# Altium schematic sheet power-section.SchDoc
size B
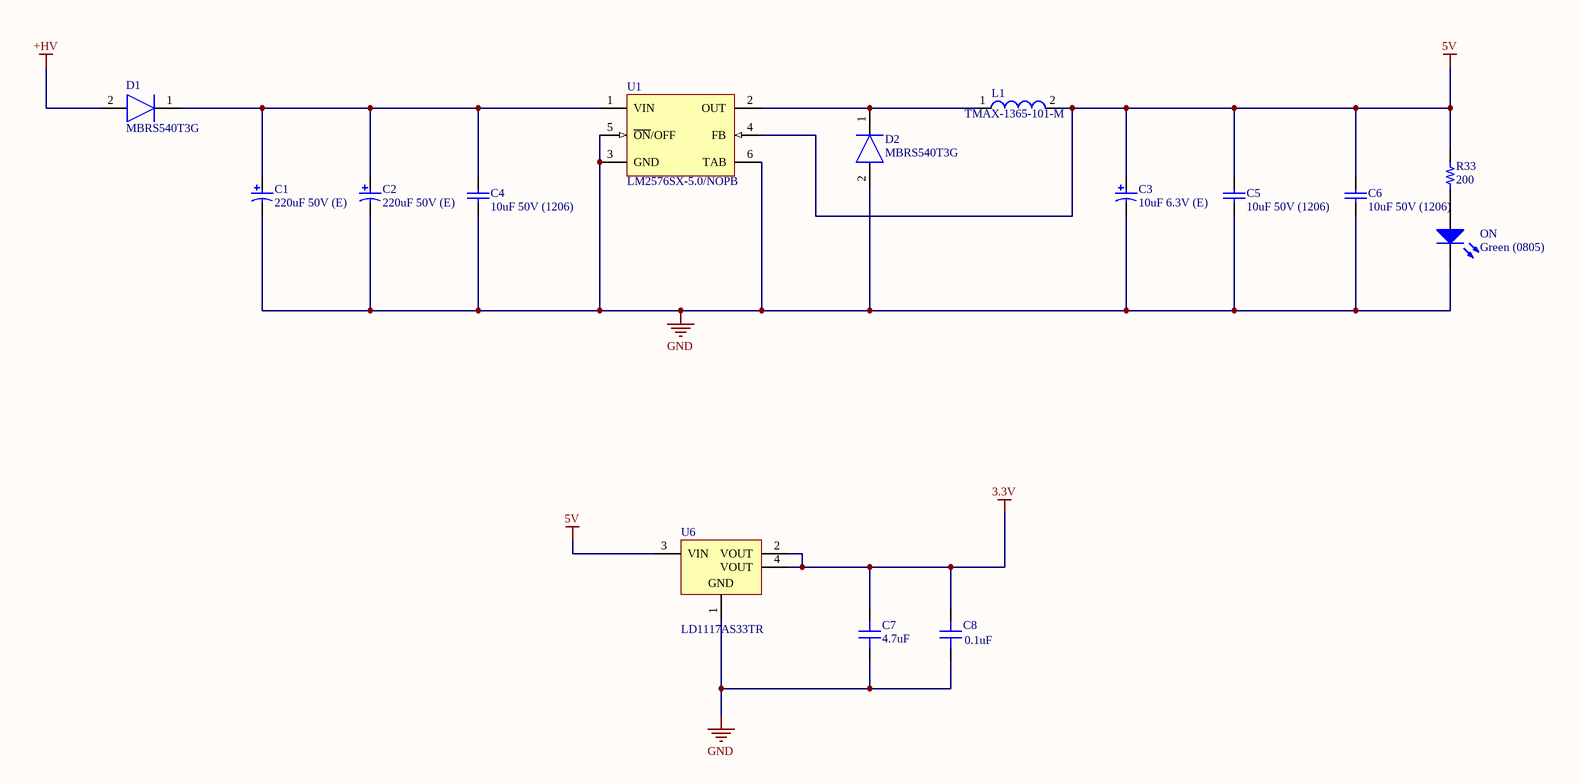
[diagram p0: power-section.SchDoc]

## Parts
C1  220uF 50V (E)  [PNSC-EEE-1HA221P_L]
C2  220uF 50V (E)  [PNSC-EEE-1HA221P_L]
C3  10uF 6.3V (E)  [NIC-CAPA2-8X10_V]
C4  10uF 50V (1206)  [CAPC3216X229X50LL20T25]
C5  10uF 50V (1206)  [CAPC3216X229X50LL20T25]
C6  10uF 50V (1206)  [CAPC3216X229X50LL20T25]
C7  4.7uF  [CAP 1206_3216 - 1.8MM]
C8  0.1uF  [CAP 0603_1608]
D1  MBRS540T3G  [DIOM7958X256N]
D2  MBRS540T3G  [DIOM7958X256N]
L1  TMAX-1365-101-M  [WE-HCI-1365]
ON  Green (0805)  [0805_A]
R33  200  [RES 0603_1608]
U1  LM2576SX-5.0/NOPB  [KTT0005B_M]
U6  LD1117AS33TR  [SOT-223_M]

## Nets
3.3V: C7.2 C8.2 U6.2(VOUT) U6.4(VOUT)
5V: C3.1 C5.2 C6.2 L1.2 R33.2 U1.4(FB) U6.3(VIN)
+HV: D1.2(A)
GND: C1.2 C2.2 C3.2 C4.1 C5.1 C6.1 C7.1 C8.1 D2.2(A) ON.1(K) U1.3(GND) U1.5(~{ON}/OFF) U1.6(TAB) U6.1(GND)
NetC1_1: C1.1 C2.1 C4.2 D1.1(K) U1.1(VIN)
NetD2_1: D2.1(K) L1.1 U1.2(OUT)
NetON_2: ON.2(A) R33.1

## Notes on the sheet
- Title
- Size:
- Date:
- B
- Number:
- Time:
- Revision:
- Sheet
- of
- Maptix Co.,Ltd
- 99/193 Atoll Bali Beach
- Khlong Luang Phaeng
- Chacheongsao
- Thailand 24000
- File:

## Library data of the parts
C1 C2 = CMP-2000-06200-1: Aluminum Electrolytic Capacitor, 220 uF, +/- 20%, 50 V, -40 to 85 degC, 2-Pin SMD, RoHS, Tape and Reel; Manufacturer: Panasonic; Lifetime @ Temperature: 2000hours@85°C; AE Capacitor Case: RadialCan-SMD; Capacitance: 220µF; Ripple Current AC: 300mA; SVHC: ToBeAdvised; Product Range: PANASONIC-SSeries; Datasheet Version: 11/2012; Manufacturer URL: http://www.panasonic.com/; Packaging: CutTape; Life Time @ Temperature: 2000hours@85°C; Capacitor Case Style: RadialCan-SMD; Capacitance Tolerance ±: ±20%; Mounting Technology: SurfaceMount; Operating Temperature Max: 85°C; Capacitance Tolerance: ±20%; Package Description: 2-Pin Surface Mount Device, Body 10.3 x 10.3 mm; Voltage Rating: 50V; Package Reference: SMD; Diameter: 10mm; Height: 10.2mm; Operating Temperature Min: -40°C; Datasheet URL: http://datasheet.octopart.com/EEE-1HA221P-Panasonic-datasheet-13265900.pdf
C3 = CMP-0687-00071-1: Aluminum Electrolytic Capacitor, UD Series, Low Impedance, 1000 uF, 6.3 V, + / - 20%, -55 to 105 degC, Chip Type, 8 x 10 mm D x L, Pb-Free, Reel; Manufacturer: Nichicon; PartNumber: UUD0J102MNL1GS; Impedance: 0.17 Ohm; Endurance Time: 5000 h; Rated Capacitance: 1000 uF; Rated Ripple Current (at 100kHz): 450 mA; Packing: Dia382mm Reel; Tolerance Rated Capacitance: -20 to 20%; Diameter: 8 mm; ComponentLink3Description: Package Specification; Mounting Technology: Surface Mount; RoHS: TRUE; ComponentLink3URL: http://products.nichicon.co.jp/en/pdf/XJA043/e-ud.pdf; Length: 10 mm; PackageDescription: 2-Pin Surface Mount Device, Diameter 8 mm, Height 10 mm, Pitch 6.5 mm; DatasheetVersion: 08/2012; ComponentLink2Description: Datasheet; ComponentLink1URL: http://www.nichicon.co.jp/; ComponentLink1Description: Manufacturer URL; Rated Voltage: 6.3 V; ComponentLink2URL: http://products.nichicon.co.jp/en/pdf/XJA043/e-ud.pdf; PackageReference: CAPAE-D8H10
C4-C6 = CMP-2000-05863-1: Chip Capacitor, 10 uF, +/- 10%, 25 V, -55 to 85 degC, 1206 (3216 Metric), RoHS, Tape and Reel; Manufacturer: AVX; Rated Voltage: 25V; Dielectric: X5R; Capacitance: 10µF; Mounting Technology: SurfaceMount; Package Reference: 1206; Tolerance (%): ±10%; Manufacturer URL: http://www.avx.com/; Datasheet URL: http://datasheets.avx.com/cx5r.pdf; Package Description: 2-Pin Surface Mount Device, Body 3.2 x 1.6 mm; Datasheet Version: 05/2016; Case Size/Dimension: 1206
C7 = C1206C335K4PACTU: CAP CERAMIC 16V X5R 1206; Manufacturer: KEMET; Capacitance: 3.3µF; Tolerance: ±10%; Part Number: C1206C335K4PACTU; Value: 4.7uF; Applications: General Purpose; ComponentLink1Description: Datasheet; ComponentLink1URL: https://api.kemet.com/component-edge/download/datasheet/C1206C335K4PACTU.pdf; ComponentLink2Description: DigiKey Link; ComponentLink2URL: http://digikey.com/product-detail/en/kemet/C1206C335K4PACTU/399-1264-1-ND/411539; Device Package: 1206 (3216 Metric); LastUpdated: 1/2/2020 12:03:41 AM; Lifecycle Status: Active; Minimum Order: 1; Mounting Type: Surface Mount, MLCC; Operating Temperature: -55°C ~ 85°C; Package / Case: 1206 (3216 Metric); Packaging: ReReel; PartId: 19546; Part Status: Active; Price: 0.00; Series: SMD Comm X5R; Size / Dimension: 0.126" L x 0.063" W (3.20mm x 1.60mm); Supplier 1: DigiKey; Supplier Part Number 1: 399-1264-1-ND; Temperature Coefficient: X5R; Thickness (Max): 0.071" (1.80mm); Voltage - Rated: 16V
C8 = VJ0603Y332JXACW1BC: CAP CERAMIC 50V X7R 0603; Manufacturer: Vishay Vitramon; Capacitance: 3300pF; Tolerance: ±5%; Part Number: VJ0603Y332JXACW1BC; Value: 0.1uF; Applications: General Purpose; ComponentLink1Description: Datasheet; ComponentLink1URL: https://www.vishay.com/docs/28548/vjw1bcbascomseries.pdf; ComponentLink2Description: DigiKey Link; ComponentLink2URL: http://digikey.com/product-detail/en/vishay-vitramon/VJ0603Y332JXACW1BC/720-VJ0603Y332JXACW1BCCT-ND/11198425; Device Package: 0603 (1608 Metric); LastUpdated: 1/2/2020 12:01:35 AM; Lifecycle Status: Active; Minimum Order: 1; Mounting Type: Surface Mount, MLCC; Operating Temperature: -55°C ~ 125°C; Package / Case: 0603 (1608 Metric); Packaging: Unknown; PartId: 26247; Part Status: Active; Price: 0.00; Series: VJ; Size / Dimension: 0.063" L x 0.031" W (1.60mm x 0.80mm); Supplier 1: DigiKey; Supplier Part Number 1: 720-VJ0603Y332JXACW1BCCT-ND; Temperature Coefficient: X7R; Thickness (Max): 0.034" (0.87mm); Voltage - Rated: 50V
D1 D2 = MBRS540T3G: Diode; Manufacturer_Name: ON Semiconductor; Allied_Number: 70100196; Datasheet Link: http://www.onsemi.com/pub/Collateral/MBRS540T3-D.PDF; Height: 2.56mm; Manufacturer_Part_Number: MBRS540T3G; Mouser Part Number: 863-MBRS540T3G; Mouser Price/Stock: https://www.mouser.com/Search/Refine.aspx?Keyword=863-MBRS540T3G; RS Part Number: 6880512; RS Price/Stock: https://uk.rs-online.com/web/p/products/6880512; Allied Price/Stock: http://www.alliedelec.com/on-semiconductor-mbrs540t3g/70100196/
L1 = CMP-1351-00012-1: SMD Flat Wire High Current Inductor WE-HCI, L=33.0 µH; Manufacturer: Wuerth Elektronik; PartNumber: 7443551331; Inductance: 33.0 ÂµH; ComponentLink1Description: Manufacturer URL; ComponentLink1URL: http://www.we-online.com; PackageDescription: Inductor, 2-Leads, Body 13.2 x 12.8 mm; ComponentLink2URL: http://katalog.we-online.de/kataloge/eisos/media/pdf/7443551331.pdf; ComponentLink2Description: Datasheet; PackageReference: WE-HCI-1365
ON = CMP-1426-00007-1: SMD mono-color Chip LED, WL-SMCW, Green; PartNumber: 150080GS75000; Manufacturer: Wuerth Elektronik; PackageReference: 0805_A; Color: Green; ComponentLink2URL: http://katalog.we-online.com/led/datasheet/150080GS75000.pdf; ComponentLink1URL: http://www.we-online.com; ComponentLink1Description: Manufacturer URL; ComponentLink2Description: Datasheet
R33 = CRCW060329K4FKEA: Resistor; Manufacturer: Vishay Dale; Power (Watts): 0.1W, 1/10W; Resistance: 29.4 kOhms; Temperature Coefficient: ±100ppm/°C; Tolerance: ±1%; Part Number: CRCW060329K4FKEA; Value: 200; ComponentLink1Description: Datasheet; ComponentLink1URL: http://www.vishay.com/docs/20035/dcrcwe3.pdf; ComponentLink2Description: DigiKey Link; ComponentLink2URL: http://digikey.com/product-detail/en/vishay-dale/CRCW060329K4FKEA/541-29.4KHCT-ND/1179975; Composition: Thick Film; Device Package: 0603 (1608 Metric); Features: Automotive AEC-Q200; Height - Seated (Max): 0.020" (0.50mm); LastUpdated: 1/2/2020 12:06:58 AM; Lifecycle Status: Active; Minimum Order: 1; Number of Terminations: 2; Operating Temperature: -55°C ~ 155°C; Package / Case: 0603 (1608 Metric); Packaging: TapeAndReel; PartId: 7975; Part Status: Active; Price: 0.00; Ratings: AEC-Q200; Series: CRCW; Size / Dimension: 0.061" L x 0.033" W (1.55mm x 0.85mm); Supplier 1: DigiKey; Supplier Part Number 1: 541-29.4KHCT-ND; Supplier Device Package: 0603
U1 = CMP-0069-00122-3: SIMPLE SWITCHER® 3A Step-Down Voltage Regulator, 5-pin TO-263, Pb-Free; Manufacturer: Texas Instruments; PackageTopMarking: NSUZXYTTE#*LM2576S*-5.0 P+; PowerWise: N; PackageDescription: TO-263, Molded, .400 x .390 x .180in, 5 Lead, .067in Pitch, Surface Mount; PinCount: 5; PackageReference: KTT0005B; ComponentLink1Description: Datasheet URL; ComponentLink1URL: http://www.ti.com/general/docs/lit/getliterature.tsp?genericPartNumber=LM2576&fileType=pdf; Code_JEDEC: MO-169-AB; CompType: Switcher; RoHS: Y
U6 = CMP-0244-00316-1: 1A, Low Drop Positive Voltage Regulator, 3.3V, 4-Pin SOT-223, Tape and Reel; ComponentLink1Description: Manufacturer URL; DatasheetVersion: 2/12/2011; PackageVersion: 2010; ComponentLink1URL: http://www.st.com; ComponentLink2Description: Datasheet; ComponentLink2URL: http://www.st.com/internet/com/TECHNICAL_RESOURCES/TECHNICAL_LITERATURE/DATASHEET/CD00002116.pdf; PackageDescription: 4-Pin SOT-223 Package, 6.5 x 3.5 mm Body, 2.3 mm Pitch, 7 mm Lead Span; PackageReference: SOT-223